# Altium schematic sheet JBC_PD_USB.SchDoc
size A4
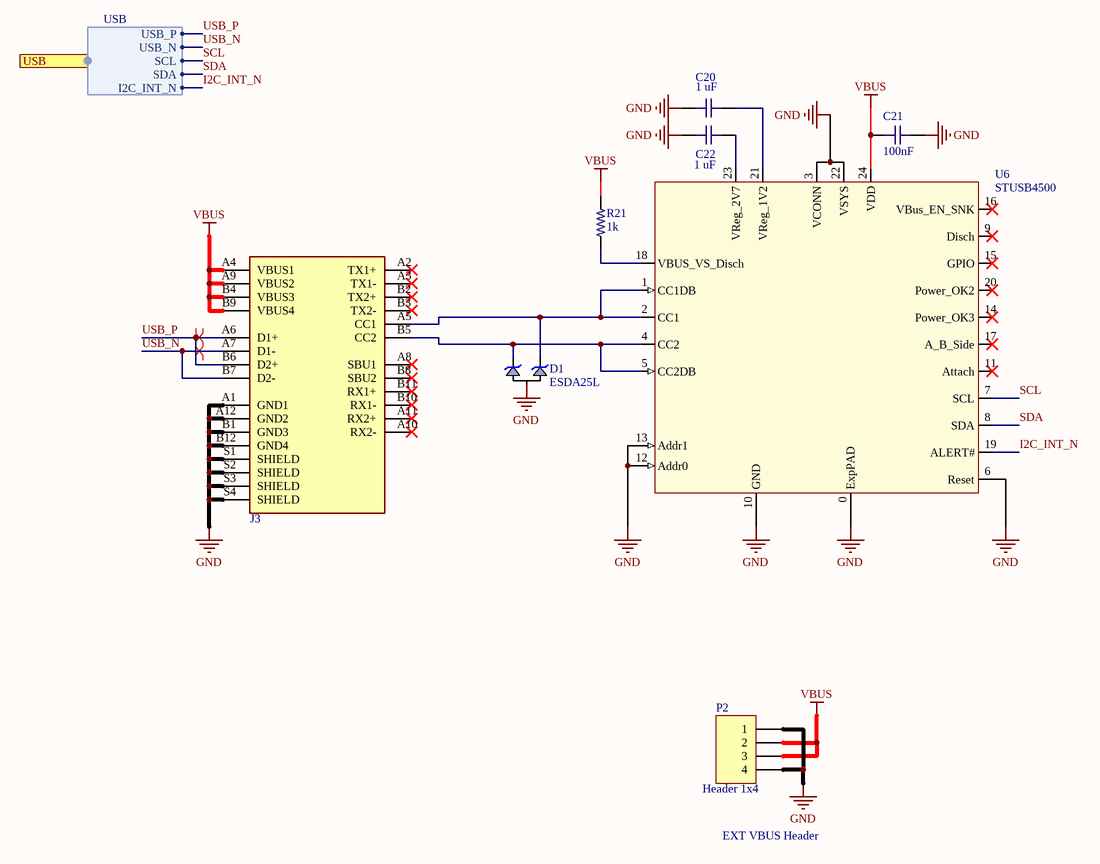
[diagram p0: JBC_PD_USB.SchDoc]

## Parts
C20  value 1 uF  [C0603-IPC]  (hidden comment: C0603 1uF 10V X7R)
C21  value 100nF  [C0603-IPC]  (hidden comment: C0603 100nF 25V X7R)
C22  value 1 uF  [C0603-IPC]  (hidden comment: C0603 1uF 10V X7R)
D1  ESDA25L  [SOT23-3L]
J3  USB C  [Molex USB-C]  (value not drawn)
P2  Header 1x4  [HEADER 1X4 SMD 2.54mm]
R21  value 1k  [R0603-IPC]  (hidden comment: R0603 1K 1%)
U6  STUSB4500  [QFN24 - 4X4MM - PITCH 0.5MM - EXPOSEDPAD]

## Ports
USB (harness USB)

## Harnesses
USB: USB_P, USB_N, SCL, SDA, I2C_INT_N

## Nets
GND: C20.1 C21.2 C22.1 D1.3(A) J3.A1(GND1) J3.A12(GND2) J3.B1(GND3) J3.B12(GND4) J3.S1(SHIELD) J3.S2(SHIELD) J3.S3(SHIELD) J3.S4(SHIELD) P2.1 P2.4 U6.0(ExpPAD) U6.3(VCONN) U6.6(Reset) U6.10(GND) U6.12(Addr0) U6.13(Addr1) U6.22(VSYS)
VBUS: C21.1 J3.A4(VBUS1) J3.A9(VBUS2) J3.B4(VBUS3) J3.B9(VBUS4) P2.2 P2.3 R21.2 U6.24(VDD)
I2C_INT_N: U6.19(ALERT#) ; port USB.I2C_INT_N
SCL: U6.7(SCL) ; port USB.SCL
SDA: U6.8(SDA) ; port USB.SDA
USB_N: J3.A7(D1-) J3.B7(D2-) ; port USB.USB_N
USB_P: J3.A6(D1+) J3.B6(D2+) ; port USB.USB_P
NetC20_2: C20.2 U6.21(VReg_1V2)
NetC22_2: C22.2 U6.23(VReg_2V7)
NetD1_1: D1.1(K1) J3.A5(CC1) U6.1(CC1DB) U6.2(CC1)
NetD1_2: D1.2(K2) J3.B5(CC2) U6.4(CC2) U6.5(CC2DB)
NetR21_1: R21.1 U6.18(VBUS_VS_Disch)

Not connected (* = marked no-connect by the designer): J3 A2(TX1+)* A3(TX1-)* A8(SBU1)* A10(RX2-)* A11(RX2+)* B2(TX2+)* B3(TX2-)* B8(SBU2)* B10(RX1-)* B11(RX1+)*; U6 9(Disch)* 11(Attach)* 14(Power_OK3)* 15(GPIO)* 16(VBus_EN_SNK)* 17(A_B_Side)* 20(Power_OK2)*

## Layout directives
differential pair: USB_N, USB_P

## Notes on the sheet
- EXT VBUS Header

## Library data of the parts
C20 C22 = C0603 1uF 10V X7R: Chip Capacitor, 0603, 1uF +/- 0.1uF, 10V, X7R; Supplier 1: Digi-Key; Supplier Part Number 1: 1276-1946-1-ND; Max. Voltage: 10V; EIA Code: X7R
C21 = C0603 100nF 25V X7R: Chip Capacitor, 0603, 100nF, 25V, X7R; EIA Code: X7R; Max. Voltage: 25V; Supplier 1: Digi-Key; Supplier Part Number 1: 490-1524-1-ND
D1 = ESDA25L: Dual Transil Array For ESD Protection in SOT23-3 Vbr = 25V; Manufacturer: STMicroelectronics; Supplier 1: Digi-Key; Supplier 2: Mouser; Supplier 3: LCSC; Supplier Part Number 1: 497-4642-1-ND; Supplier Part Number 2: 511-ESDA25L; Supplier Part Number 3: C95343; Manufacturer Part Number: ESDA25L
J3 = USB C: USB-C USB 3.1 Gen 2, Superspeed+_ Receptacle Connector 24 Position Surface Mount, Right Angle; Through Hole; MF: Molex; MP: 1054500101; Package: None; Digi-Key_Part_Number: WM12856CT-ND; SnapEDA_Link: https://www.snapeda.com/parts/1054500101/Molex/view-part/448528/?ref=snap; Digi-Key_Purchase_URL: https://www.digikey.tw/product-detail/en/molex/1054500101/WM12856CT-ND/5843891?utm_source=snapeda&utm_medium=aggregator&utm_campaign=symbol; Value: *; Supplier 1: Digi-Key; Supplier 2: Mouser; Supplier 3: LCSC; Supplier Part Number 1: WM12856CT-ND; Supplier Part Number 2: 538-105450-0101; Supplier Part Number 3: C134092
P2 = Header 1x4: Header, 4-Pin; LatestRevisionDate: 17-Jul-2002; LatestRevisionNote: Re-released for DXP Platform.; Publisher: Altium Limited
R21 = R0603 1K 1%: RES SMD 1K OHM 1% 1/10W 0603; Temperature Coefficient: ±100ppm/°C; Operating Temperature: -55°C ~ 155°C; Features: Automotive AEC-Q200; Tolerance: ±1%; Supplier 1: Digi-Key; Supplier Part Number 1: RMCF0603FG1K00CT-ND
U6 = STUSB4500QTR: Standalone USB PD controller  with SINK auto-run mode in QFN24 4x4mm; Manufacturer: STMicroelectronics; Part Number: Standalone USB PD controller  with SINK auto-run mode in QFN24 4x4mm; Manufacturer’s ordering code: STUSB4500QTR; Value: STUSB4500; Supplier 1: Digi-Key; Supplier 2: Mouser; Supplier Part Number 1: 497-18060-1-ND; Supplier Part Number 2: 511-STUSB4500QTR